# Altium schematic sheet Audio.SchDoc: Evaluation Board 3.2
size A3; Organization: Toradex AG; Address1: Altsagenstrasse 5; Address2: Horw; Address3: 6048; Address4: Switzerland; DocumentNumber: 10; Revision: V3.2; SheetNumber: 10; SheetTotal: 23; PageSetup: Record=PageOptions|CenterHorizontal=True|CenterVertical=True|PrintScale=0.73|XCorrection=1.00|YCorrection=1.00|PrintKind=0|BorderSize=5000000|LeftOffset=0|BottomOffset=0|Orientation=2|PaperLength=1000|PaperWidth=1000|Scale=100|PaperSource=7|PrintQuality=-4|MediaType=1|DitherType=10|PaperKind=A4|PrintScaleMode=1
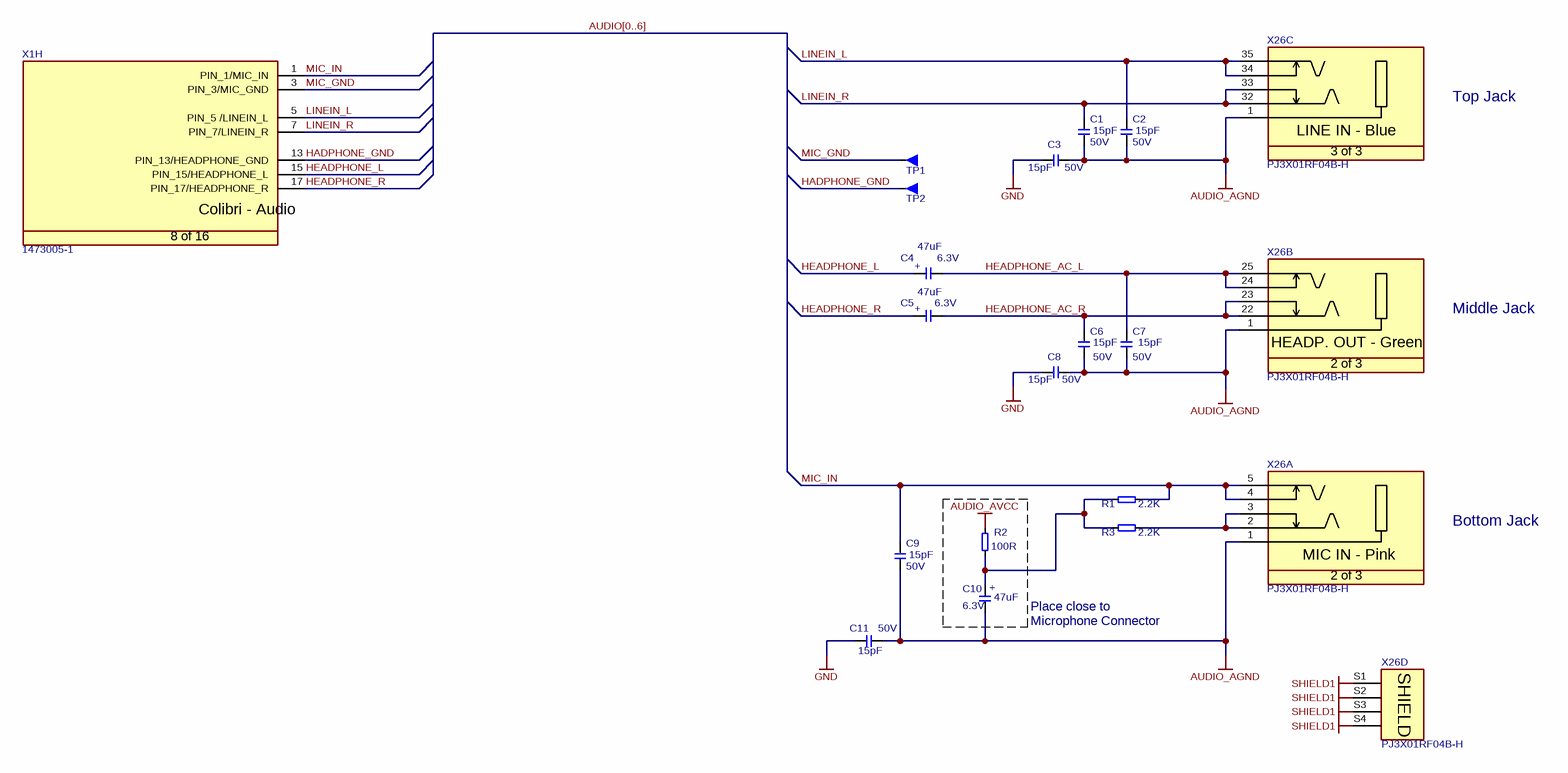
[diagram p0: Audio.SchDoc]

## Parts
C1  Rating: 50V  [T_CAPC0603X33N]  (hidden comment: 15pF)
C2  Rating: 50V  [T_CAPC0603X33N]  (hidden comment: 15pF)
C3  Rating: 50V  [T_CAPC0603X33N]  (hidden comment: 15pF)
C4  Rating: 6.3V  [CAPMP3528X210N]  (hidden comment: 47uF)
C5  Rating: 6.3V  [CAPMP3528X210N]  (hidden comment: 47uF)
C6  Rating: 50V  [T_CAPC0603X33N]  (hidden comment: 15pF)
C7  Rating: 50V  [T_CAPC0603X33N]  (hidden comment: 15pF)
C8  Rating: 50V  [T_CAPC0603X33N]  (hidden comment: 15pF)
C9  Rating: 50V  [T_CAPC0603X33N]  (hidden comment: 15pF)
C10  Rating: 6.3V  [CAPMP3528X210N]  (hidden comment: 47uF)
C11  Rating: 50V  [T_CAPC0603X33N]  (hidden comment: 15pF)
R1  2.2K  [T_RESC0603X30N]
R2  100R  [T_RESC0603X30N]
R3  2.2K  [T_RESC0603X30N]
TP1  Testpin  [T_TP-THT]  (value not drawn)
TP2  Testpin  [T_TP-THT]  (value not drawn)
X1  Manufacturer Part No.: 1473005-1  [T_Tyco_1473005-1]  (hidden comment: CON-Tyco-1473005-1-200-0.6mm)  (part H of 16)
X26  Manufacturer Part No.: PJ3X01RF04B-H  [T_AUK_PJ3X01RF04B-H]  (hidden comment: AUK-PJ3X01RF04B-H)  (parts A,B,C,D of 4)

## Nets
AUDIO_AGND: C1.1 C2.1 C3.2 C6.1 C7.1 C8.2 C9.1 C10.2 C11.1 X26.1
AUDIO_AVCC: R2.2
GND: C3.1 C8.1 C11.2
SHIELD1: X26.S1(SHIELD) X26.S2(SHIELD) X26.S3(SHIELD) X26.S4(SHIELD)
HADPHONE_GND: TP2.1 X1.13(PIN_13/HEADPHONE_GND)
HEADPHONE_AC_L: C4.2 C7.2 X26.24 X26.25
HEADPHONE_AC_R: C5.2 C6.2 X26.22 X26.23
HEADPHONE_L: C4.1 X1.15(PIN_15/HEADPHONE_L)
HEADPHONE_R: C5.1 X1.17(PIN_17/HEADPHONE_R)
LINEIN_L: C2.2 X1.5(PIN_5_/LINEIN_L) X26.34 X26.35
LINEIN_R: C1.2 X1.7(PIN_7/LINEIN_R) X26.32 X26.33
MIC_GND: TP1.1 X1.3(PIN_3/MIC_GND)
MIC_IN: C9.2 R1.2 X1.1(PIN_1/MIC_IN) X26.4 X26.5
NetC10_1: C10.1 R1.1 R2.1 R3.1
NetR3_2: R3.2 X26.2 X26.3

## Buses and harness runs
bus AUDIO[0..6]

## Notes on the sheet
- Top Jack
- Middle Jack
- Bottom Jack
- Place close to
- (near C10) Microphone Connector
- Title
- Size:
- Date:
- A3
- Number:
- Time:
- Revision:
- Sheet
- of
- File:
- (in symbol C-TA-47uF-6.3V-20%-3216) +
- (in symbol CON-AUK-PJ3X01RF04B-H, part A) MIC IN - Pink; 2 of 3
- (in symbol CON-AUK-PJ3X01RF04B-H, part B) HEADP. OUT - Green; 2 of 3
- (in symbol CON-AUK-PJ3X01RF04B-H, part C) LINE IN - Blue; 3 of 3
- (in symbol CON-Tyco-1473005-1-200-0.6mm, part H) Colibri - Audio; 8 of 16

## Library data of the parts
C1-C3 C6-C9 C11 = C-NPO-15pF-50V-10%-0603: Capacitor Ceramic NPO 15pF 50V 10% 0603; Tolerance: 10%; Type: NPO; Value: 15pF
C4 C5 C10 = C-TA-47uF-6.3V-20%-3216: Capacitor TA 47uF 6.3V 20% 3216; Tolerance: 20%; Type: TA; Value: 47uF
R1 R3 = R-2.2KR-63mW-5%-0603: Resistor 2.2Kohm 63mW 5% 0603; Value: 2.2KR; Rating: 63mW; Tolerance: 5%
R2 = R-100R-63mW-5%-0603: Resistor 100 ohm 63mW 5% 0603; Rating: 63mW; Tolerance: 5%; Value: 100R
TP1 TP2 = Testpin: Testpin TH
X1 = CON-Tyco-1473005-1-200-0.6mm: SODIMM Connector; Manufacturer Name: Tyco; No. of ways: 200
X26 = CON-AUK-PJ3X01RF04B-H: 3x Audiojack stereo, 3.5mm; Manufacturer Name: AUK; No. of ways: 13